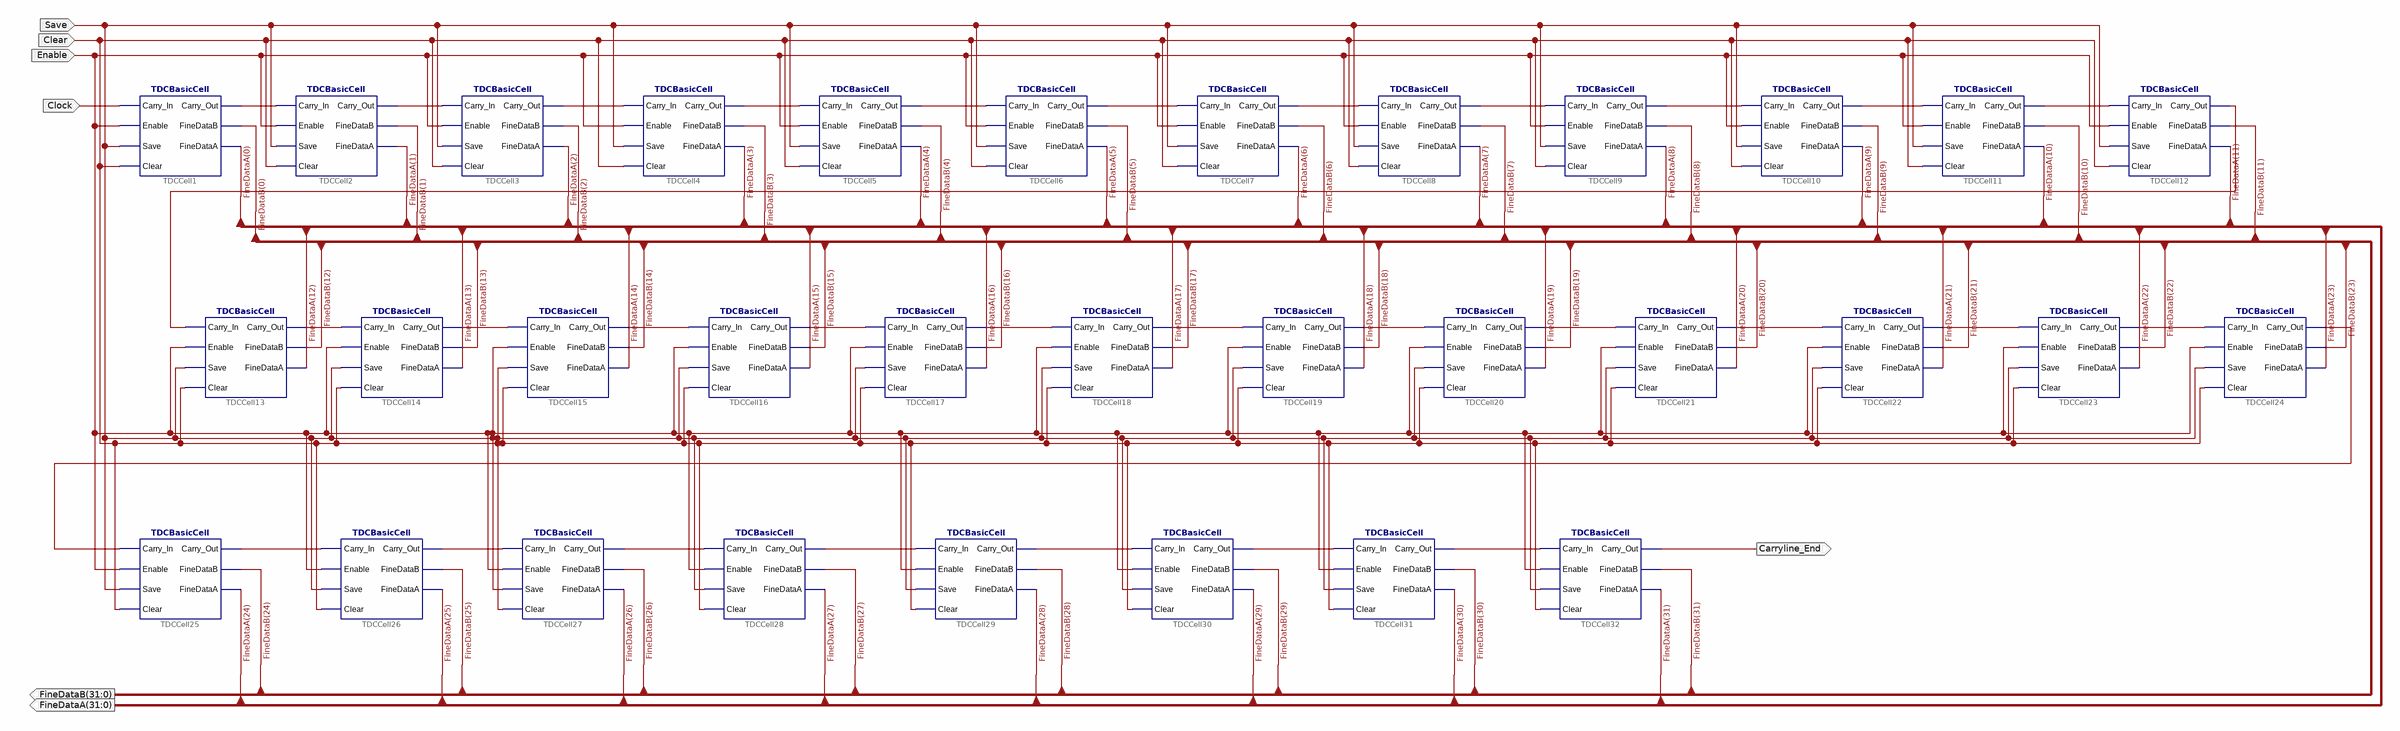
[diagram p0: schematic sheet 1]
// Xilinx ISE schematic SingleFineDataChain.sch (virtex4) as structural Verilog: 32 symbols, 7 ports
module SingleFineDataChain (
  input  Clock,
  input  Enable,
  input  Save,
  input  Clear,
  output [31:0] FineDataB,
  output Carryline_End,
  output [31:0] FineDataA
);

  wire CarryChain_O1, CarryChain_OLast, XLXN_13, XLXN_14, XLXN_26, XLXN_30, XLXN_31, XLXN_32, XLXN_33,
       XLXN_34, XLXN_35, XLXN_36, XLXN_75, XLXN_76, XLXN_77, XLXN_78, XLXN_79, XLXN_80, XLXN_81, XLXN_82,
       XLXN_84, XLXN_85, XLXN_86, XLXN_110, XLXN_112, XLXN_113, XLXN_114, XLXN_115, XLXN_116, XLXN_118,
       XLXN_158;

  TDCBasicCell #(.RLOC("X0Y0")) TDCCell1 (
    .Carry_In(Clock), .Carry_Out(CarryChain_O1), .Clear(Clear), .Enable(Enable), .FineDataA(FineDataA[0]),
    .FineDataB(FineDataB[0]), .Save(Save));
  TDCBasicCell #(.RLOC("X0Y1")) TDCCell2 (
    .Carry_In(CarryChain_O1), .Carry_Out(XLXN_13), .Clear(Clear), .Enable(Enable), .FineDataA(FineDataA[1]),
    .FineDataB(FineDataB[1]), .Save(Save));
  TDCBasicCell #(.RLOC("X0Y2")) TDCCell3 (
    .Carry_In(XLXN_13), .Carry_Out(XLXN_14), .Clear(Clear), .Enable(Enable), .FineDataA(FineDataA[2]),
    .FineDataB(FineDataB[2]), .Save(Save));
  TDCBasicCell #(.RLOC("X0Y3")) TDCCell4 (
    .Carry_In(XLXN_14), .Carry_Out(XLXN_26), .Clear(Clear), .Enable(Enable), .FineDataA(FineDataA[3]),
    .FineDataB(FineDataB[3]), .Save(Save));
  TDCBasicCell #(.RLOC("X0Y4")) TDCCell5 (
    .Carry_In(XLXN_26), .Carry_Out(XLXN_30), .Clear(Clear), .Enable(Enable), .FineDataA(FineDataA[4]),
    .FineDataB(FineDataB[4]), .Save(Save));
  TDCBasicCell #(.RLOC("X0Y5")) TDCCell6 (
    .Carry_In(XLXN_30), .Carry_Out(XLXN_31), .Clear(Clear), .Enable(Enable), .FineDataA(FineDataA[5]),
    .FineDataB(FineDataB[5]), .Save(Save));
  TDCBasicCell #(.RLOC("X0Y6")) TDCCell7 (
    .Carry_In(XLXN_31), .Carry_Out(XLXN_32), .Clear(Clear), .Enable(Enable), .FineDataA(FineDataA[6]),
    .FineDataB(FineDataB[6]), .Save(Save));
  TDCBasicCell #(.RLOC("X0Y7")) TDCCell8 (
    .Carry_In(XLXN_32), .Carry_Out(XLXN_33), .Clear(Clear), .Enable(Enable), .FineDataA(FineDataA[7]),
    .FineDataB(FineDataB[7]), .Save(Save));
  TDCBasicCell #(.RLOC("X0Y8")) TDCCell9 (
    .Carry_In(XLXN_33), .Carry_Out(XLXN_34), .Clear(Clear), .Enable(Enable), .FineDataA(FineDataA[8]),
    .FineDataB(FineDataB[8]), .Save(Save));
  TDCBasicCell #(.RLOC("X0Y9")) TDCCell10 (
    .Carry_In(XLXN_34), .Carry_Out(XLXN_35), .Clear(Clear), .Enable(Enable), .FineDataA(FineDataA[9]),
    .FineDataB(FineDataB[9]), .Save(Save));
  TDCBasicCell #(.RLOC("X0Y10")) TDCCell11 (
    .Carry_In(XLXN_35), .Carry_Out(XLXN_36), .Clear(Clear), .Enable(Enable), .FineDataA(FineDataA[10]),
    .FineDataB(FineDataB[10]), .Save(Save));
  TDCBasicCell #(.RLOC("X0Y11")) TDCCell12 (
    .Carry_In(XLXN_36), .Carry_Out(XLXN_82), .Clear(Clear), .Enable(Enable), .FineDataA(FineDataA[11]),
    .FineDataB(FineDataB[11]), .Save(Save));
  TDCBasicCell #(.RLOC("X0Y12")) TDCCell13 (
    .Carry_In(XLXN_82), .Carry_Out(XLXN_81), .Clear(Clear), .Enable(Enable), .FineDataA(FineDataA[12]),
    .FineDataB(FineDataB[12]), .Save(Save));
  TDCBasicCell #(.RLOC("X0Y13")) TDCCell14 (
    .Carry_In(XLXN_81), .Carry_Out(XLXN_80), .Clear(Clear), .Enable(Enable), .FineDataA(FineDataA[13]),
    .FineDataB(FineDataB[13]), .Save(Save));
  TDCBasicCell #(.RLOC("X0Y14")) TDCCell15 (
    .Carry_In(XLXN_80), .Carry_Out(XLXN_79), .Clear(Clear), .Enable(Enable), .FineDataA(FineDataA[14]),
    .FineDataB(FineDataB[14]), .Save(Save));
  TDCBasicCell #(.RLOC("X0Y15")) TDCCell16 (
    .Carry_In(XLXN_79), .Carry_Out(XLXN_78), .Clear(Clear), .Enable(Enable), .FineDataA(FineDataA[15]),
    .FineDataB(FineDataB[15]), .Save(Save));
  TDCBasicCell #(.RLOC("X0Y16")) TDCCell17 (
    .Carry_In(XLXN_78), .Carry_Out(XLXN_77), .Clear(Clear), .Enable(Enable), .FineDataA(FineDataA[16]),
    .FineDataB(FineDataB[16]), .Save(Save));
  TDCBasicCell #(.RLOC("X0Y17")) TDCCell18 (
    .Carry_In(XLXN_77), .Carry_Out(XLXN_76), .Clear(Clear), .Enable(Enable), .FineDataA(FineDataA[17]),
    .FineDataB(FineDataB[17]), .Save(Save));
  TDCBasicCell #(.RLOC("X0Y18")) TDCCell19 (
    .Carry_In(XLXN_76), .Carry_Out(XLXN_75), .Clear(Clear), .Enable(Enable), .FineDataA(FineDataA[18]),
    .FineDataB(FineDataB[18]), .Save(Save));
  TDCBasicCell #(.RLOC("X0Y19")) TDCCell20 (
    .Carry_In(XLXN_75), .Carry_Out(XLXN_110), .Clear(Clear), .Enable(Enable), .FineDataA(FineDataA[19]),
    .FineDataB(FineDataB[19]), .Save(Save));
  TDCBasicCell #(.RLOC("X0Y23")) TDCCell24 (
    .Carry_In(XLXN_86), .Carry_Out(XLXN_158), .Clear(Clear), .Enable(Enable), .FineDataA(FineDataA[23]),
    .FineDataB(FineDataB[23]), .Save(Save));
  TDCBasicCell #(.RLOC("X0Y20")) TDCCell21 (
    .Carry_In(XLXN_110), .Carry_Out(XLXN_84), .Clear(Clear), .Enable(Enable), .FineDataA(FineDataA[20]),
    .FineDataB(FineDataB[20]), .Save(Save));
  TDCBasicCell #(.RLOC("X0Y21")) TDCCell22 (
    .Carry_In(XLXN_84), .Carry_Out(XLXN_85), .Clear(Clear), .Enable(Enable), .FineDataA(FineDataA[21]),
    .FineDataB(FineDataB[21]), .Save(Save));
  TDCBasicCell #(.RLOC("X0Y22")) TDCCell23 (
    .Carry_In(XLXN_85), .Carry_Out(XLXN_86), .Clear(Clear), .Enable(Enable), .FineDataA(FineDataA[22]),
    .FineDataB(FineDataB[22]), .Save(Save));
  TDCBasicCell #(.RLOC("X0Y24")) TDCCell25 (
    .Carry_In(XLXN_158), .Carry_Out(XLXN_112), .Clear(Clear), .Enable(Enable), .FineDataA(FineDataA[24]),
    .FineDataB(FineDataB[24]), .Save(Save));
  TDCBasicCell #(.RLOC("X0Y25")) TDCCell26 (
    .Carry_In(XLXN_112), .Carry_Out(XLXN_113), .Clear(Clear), .Enable(Enable), .FineDataA(FineDataA[25]),
    .FineDataB(FineDataB[25]), .Save(Save));
  TDCBasicCell #(.RLOC("X0Y26")) TDCCell27 (
    .Carry_In(XLXN_113), .Carry_Out(XLXN_114), .Clear(Clear), .Enable(Enable), .FineDataA(FineDataA[26]),
    .FineDataB(FineDataB[26]), .Save(Save));
  TDCBasicCell #(.RLOC("X0Y27")) TDCCell28 (
    .Carry_In(XLXN_114), .Carry_Out(XLXN_115), .Clear(Clear), .Enable(Enable), .FineDataA(FineDataA[27]),
    .FineDataB(FineDataB[27]), .Save(Save));
  TDCBasicCell #(.RLOC("X0Y28")) TDCCell29 (
    .Carry_In(XLXN_115), .Carry_Out(XLXN_116), .Clear(Clear), .Enable(Enable), .FineDataA(FineDataA[28]),
    .FineDataB(FineDataB[28]), .Save(Save));
  TDCBasicCell #(.RLOC("X0Y29")) TDCCell30 (
    .Carry_In(XLXN_116), .Carry_Out(XLXN_118), .Clear(Clear), .Enable(Enable), .FineDataA(FineDataA[29]),
    .FineDataB(FineDataB[29]), .Save(Save));
  TDCBasicCell #(.RLOC("X0Y30")) TDCCell31 (
    .Carry_In(XLXN_118), .Carry_Out(CarryChain_OLast), .Clear(Clear), .Enable(Enable),
    .FineDataA(FineDataA[30]), .FineDataB(FineDataB[30]), .Save(Save));
  TDCBasicCell #(.RLOC("X0Y31")) TDCCell32 (
    .Carry_In(CarryChain_OLast), .Carry_Out(Carryline_End), .Clear(Clear), .Enable(Enable),
    .FineDataA(FineDataA[31]), .FineDataB(FineDataB[31]), .Save(Save));
endmodule
